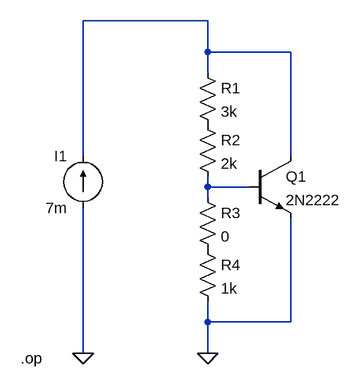
[diagram p0: schematic Draft1.asc]
Draft1.asc, the LTspice schematic file:
Version 4.1
SHEET 1 880 680
WIRE 272 -112 80 -112
WIRE 272 -64 272 -112
WIRE 400 -64 272 -64
WIRE 272 -32 272 -64
WIRE 80 96 80 -112
WIRE 400 96 400 -64
WIRE 272 144 272 128
WIRE 336 144 272 144
WIRE 272 160 272 144
WIRE 272 352 272 320
WIRE 400 352 400 192
WIRE 400 352 272 352
WIRE 80 400 80 176
WIRE 272 400 272 352
FLAG 272 400 0
FLAG 80 400 0
DATAFLAG 400 -64 ""
DATAFLAG 176 -32 "I(R1)"
DATAFLAG 496 80 "Ic(Q1)"
DATAFLAG 272 -48 "$-V(P001)"
SYMBOL res 256 -48 R0
SYMATTR InstName R1
SYMATTR Value 3k
SYMBOL res 256 32 R0
SYMATTR InstName R2
SYMATTR Value 2k
SYMBOL res 256 144 R0
SYMATTR InstName R3
SYMATTR Value 0
SYMBOL res 256 224 R0
SYMATTR InstName R4
SYMATTR Value 1k
SYMBOL npn 336 96 R0
SYMATTR InstName Q1
SYMATTR Value 2N2222
SYMBOL current 80 176 R180
WINDOW 0 24 80 Left 2
WINDOW 3 24 0 Left 2
WINDOW 123 0 0 Left 0
WINDOW 39 0 0 Left 0
SYMATTR InstName I1
SYMATTR Value 7m
TEXT -16 408 Left 2 !.op

The netlist it stands for:
* Draft1.asc
R1 N001 P001 3k
R2 P001 N002 2k
R3 N002 P002 0
R4 P002 0 1k
Q1 N001 N002 0 0 2N2222
I1 0 N001 7m
.model NPN NPN
.model PNP PNP
.lib standard.bjt
.op
.backanno
.end